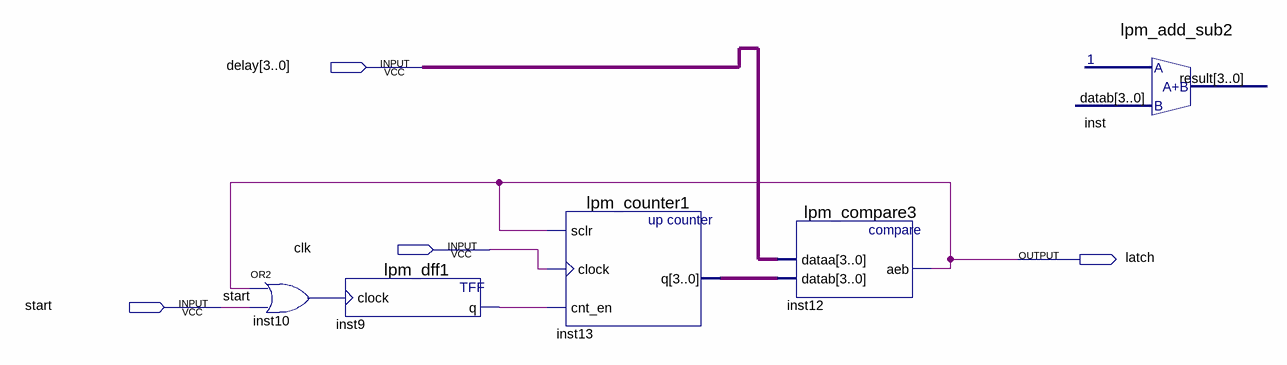
[diagram p0: schematic sheet]
// Quartus schematic delay.bdf as structural Verilog: 5 symbols, 4 pins
module delay (
  input  [3:0] delay,
  input  clk,
  input  start,
  output latch
);

  wire inst9_q, inst10_out;
  wire [3:0] inst13_q;

  or inst10 (inst10_out, latch, start);
  lpm_dff1 inst9 (.clock(inst10_out), .q(inst9_q));
  lpm_counter1 inst13 (.sclr(latch), .clock(clk), .cnt_en(inst9_q), .q(inst13_q));
  lpm_compare3 inst12 (.dataa(delay), .datab(inst13_q), .aeb(latch));
  lpm_add_sub2 inst ();  // open: datab, result
endmodule
